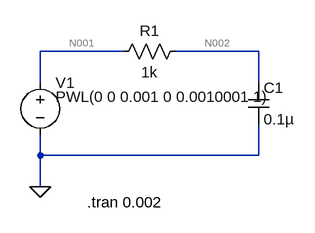
[diagram p0: schematic 02_lpf_step.asc]
02_lpf_step.asc, the LTspice schematic file:
Version 4
SHEET 1 880 680
WIRE 0 176 -128 176
WIRE 208 176 80 176
WIRE -128 224 -128 176
WIRE 208 224 208 176
WIRE -128 336 -128 304
WIRE 208 336 208 288
WIRE 208 336 -128 336
WIRE -128 384 -128 336
FLAG -128 384 0
SYMBOL cap 192 224 R0
SYMATTR InstName C1
SYMATTR Value 0.1µ
SYMBOL res -16 192 R270
WINDOW 0 32 56 VTop 2
WINDOW 3 0 56 VBottom 2
SYMATTR InstName R1
SYMATTR Value 1k
SYMBOL voltage -128 208 R0
WINDOW 3 24 38 Left 2
SYMATTR InstName V1
SYMATTR Value PWL(0 0 0.001 0 0.0010001 1)
SYMATTR Value2 AC 1 0
TEXT -56 408 Left 2 !.tran 0.002

The netlist it stands for:
* 02_lpf_step.asc
C1 N002 0 0.1µ
R1 N001 N002 1k
V1 N001 0 PWL(0 0 0.001 0 0.0010001 1) AC 1 0
.tran 0.002
.backanno
.end

* Results of the author's LTspice run, read from the files saved beside the schematic
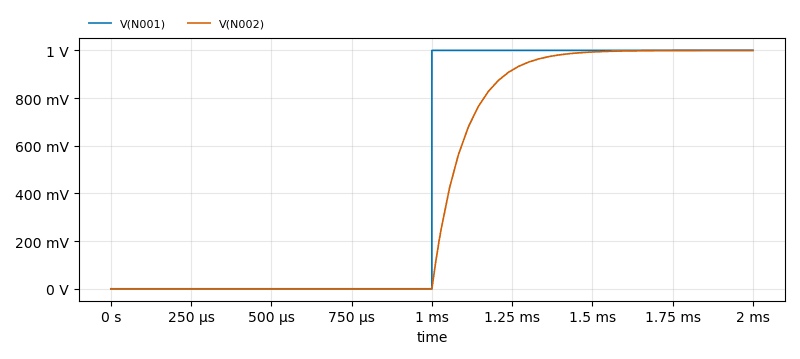
[diagram p1: Transient Analysis of 02_lpf_step.asc, plotted from the saved traces]
* Transient Analysis, 1 run:
*   V(N001): min 0 V, max 1 V, average 500 mV, rms 707.1 mV, last 1 V
*   V(N002): min 0 V, max 1 V, average 449.7 mV, rms 651.8 mV, last 1 V